# EAGLE design Poti-Con (EAGLE 5.11)
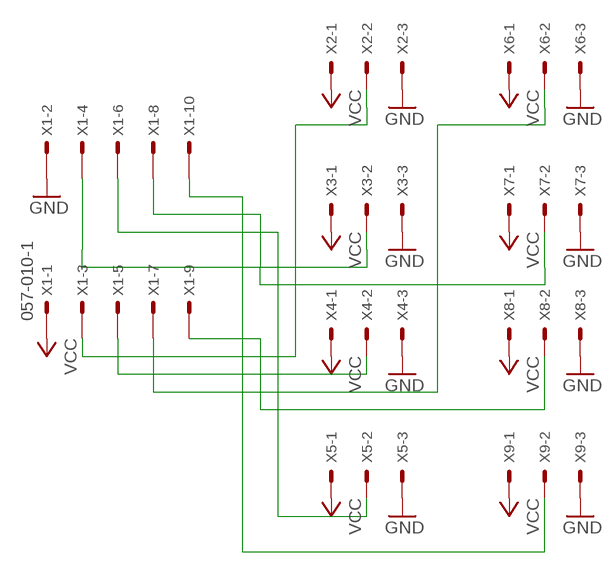
[diagram p0: schematic, sheet 1]

## Parts
X1  057-010-1  [057-010-1]
X2  22-27-2031-03  [6410-03]
X3  22-27-2031-03  [6410-03]
X4  22-27-2031-03  [6410-03]
X5  22-27-2031-03  [6410-03]
X6  22-27-2031-03  [6410-03]
X7  22-27-2031-03  [6410-03]
X8  22-27-2031-03  [6410-03]
X9  22-27-2031-03  [6410-03]

## Nets
GND: X1.2 X2.3 X3.3 X4.3 X5.3 X6.3 X7.3 X8.3 X9.3
N$1: X1.7 X6.2
N$2: X1.8 X7.2
N$3: X1.3 X2.2
N$5: X1.5 X4.2
N$6: X1.6 X5.2
N$7: X1.4 X3.2
N$9: X1.9 X8.2
N$10: X1.10 X9.2
VCC: X1.1 X2.1 X3.1 X4.1 X5.1 X6.1 X7.1 X8.1 X9.1

## Library data of the parts
X1 = con-panduit:057-010-: CONNECTOR 10-pin series 057 contact pc board low profile headers; OC_FARNELL: unknown; OC_NEWARK: unknown
X2-X9 = con-molex:22-?-03: CONNECTOR wire to board 2.54 mm (.1 inch) pitch header; OC_FARNELL: unknown; OC_NEWARK: unknown

## Board
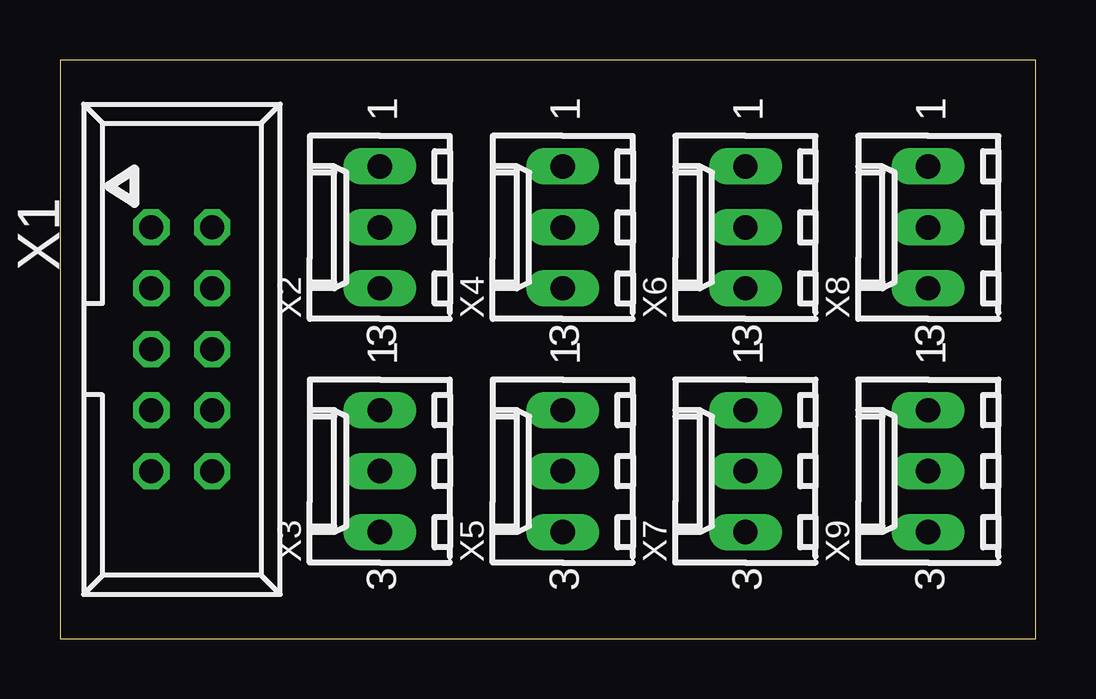
[diagram p1: board, top side]
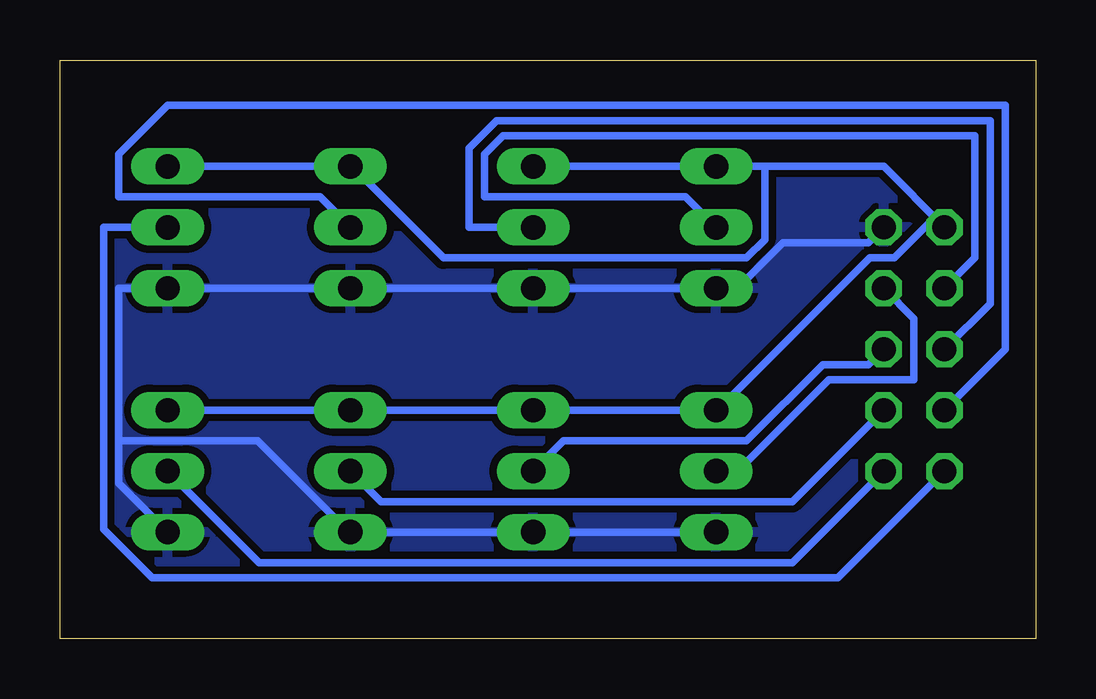
[diagram p2: board, bottom side, seen from below]

Size 40.68 x 24.12 mm. Coordinates in mm from the lower left corner, seen from the top.
Outline: 0,0 40.68,0 40.68,24.12 0,24.12 0,0
Copper layers (1*16): Top 0.035mm / dielectric 1.5mm / Bottom 0.035mm
Design rules "default *": minimum track width 12mil, minimum drill 32mil, track to track 12mil, track to pad 12mil, pad to pad 12mil, via to via 12mil, smd to smd 8mil, copper to edge 0mil, drill to drill 12mil, minimum pad ring 10mil, minimum via ring 8mil, stop-mask expansion 4mil, vias tented up to drill 0mil, thermal gap 10mil
tRestrict: area 2.9,16.2 to 4.8,18.1; area 5.4,16.2 to 7.3,18.1; area 5.4,13.7 to 7.3,15.6; area 2.9,13.7 to 4.8,15.6; area 2.9,11.1 to 4.8,13; area 5.4,11.1 to 7.3,13; area 5.4,8.6 to 7.3,10.5; area 2.9,8.6 to 4.8,10.5; area 2.9,6 to 4.8,7.9; area 5.4,6 to 7.3,7.9
vRestrict: area 1,1.9 to 9.2,22.2

### Footprints (pad centres in the part's own frame; a part is rotated, then mirrored left to right if it is on the bottom)
057-010-1 = drill 1 octagon: 1 -5.08,-1.27; 2 -5.08,1.27; 3 -2.54,-1.27; 4 -2.54,1.27; 5 0,-1.27; 6 0,1.27; 7 2.54,-1.27; 8 2.54,1.27; 9 5.08,-1.27; 10 5.08,1.27
6410-03 = drill 1.016 long: 1 2.54,0; 2 0,0; 3 -2.54,0

### Placement (x,y rotation side)
X1  5.08,12.06 270 top
X2  13.34,17.14 90 top
X3  13.34,6.99 90 top
X4  20.95,17.14 90 top
X5  20.95,6.99 90 top
X6  28.57,17.14 90 top
X7  28.57,6.99 90 top
X8  36.2,17.14 90 top
X9  36.2,6.99 90 top

### Tracks (layer width: path | path; a pad name or v marks a point on that pad's centre or on a via)
GND
  Bottom 0.305: X3.3 X5.3 21.08,4.45 X7.3 28.7,4.51 32.45,8.26 38.1,8.26 38.23,8.26 | X9.3 38.23,6.48 38.23,8.26 | 38.23,8.26 38.23,14.61 X8.3 36.07,14.61 28.7,14.61 X6.3 21.08,14.61 X4.3 13.46,14.61 X2.3 12.45,14.61 10.54,16.51 6.99,16.51 X1.2
  pour Bottom: -1.91,25.4 42.55,25.4 42.55,-1.91 -1.91,-1.91
N$1
  Bottom 0.305: X1.7 1.27,12.06 1.27,22.23 36.2,22.23 38.23,20.19 38.23,18.41 29.84,18.41 X6.2
N$2
  Bottom 0.305: X1.8 10.16,5.71 27.3,5.71 X7.2
N$3
  Bottom 0.305: X1.3 2.54,15.88 2.54,20.95 22.23,20.95 22.99,20.19 22.99,18.41 14.61,18.41 X2.2
N$5
  Bottom 0.305: X1.5 1.91,13.97 1.91,21.59 22.48,21.59 23.62,20.45 23.62,17.14 X4.2
N$6
  Bottom 0.305: X1.6 6.99,11.43 8.89,11.43 12.06,8.26 19.68,8.26 X5.2
N$7
  Bottom 0.305: X1.4 5.08,13.34 5.08,10.79 8.64,10.79 12.45,6.99 X3.2
N$9
  Bottom 0.305: X1.9 8.26,2.54 36.83,2.54 38.86,4.57 38.86,17.14 X8.2
N$10
  Bottom 0.305: X1.10 10.16,3.17 32.38,3.17 X9.2
VCC
  Bottom 0.305: X9.1 28.7,9.53 X7.1 21.08,9.53 X5.1 X3.1 13.21,9.59 6.92,15.88 5.91,15.88 4.32,17.46 X1.1 6.35,19.68 11.3,19.68 | X8.1 X6.1 28.45,19.62 24.7,15.88 12.06,15.88 11.3,16.64 11.3,19.56 11.3,19.68 | 11.3,19.68 X2.1 13.46,19.68 X4.1